# Altium project PCB_Project.PrjPcb
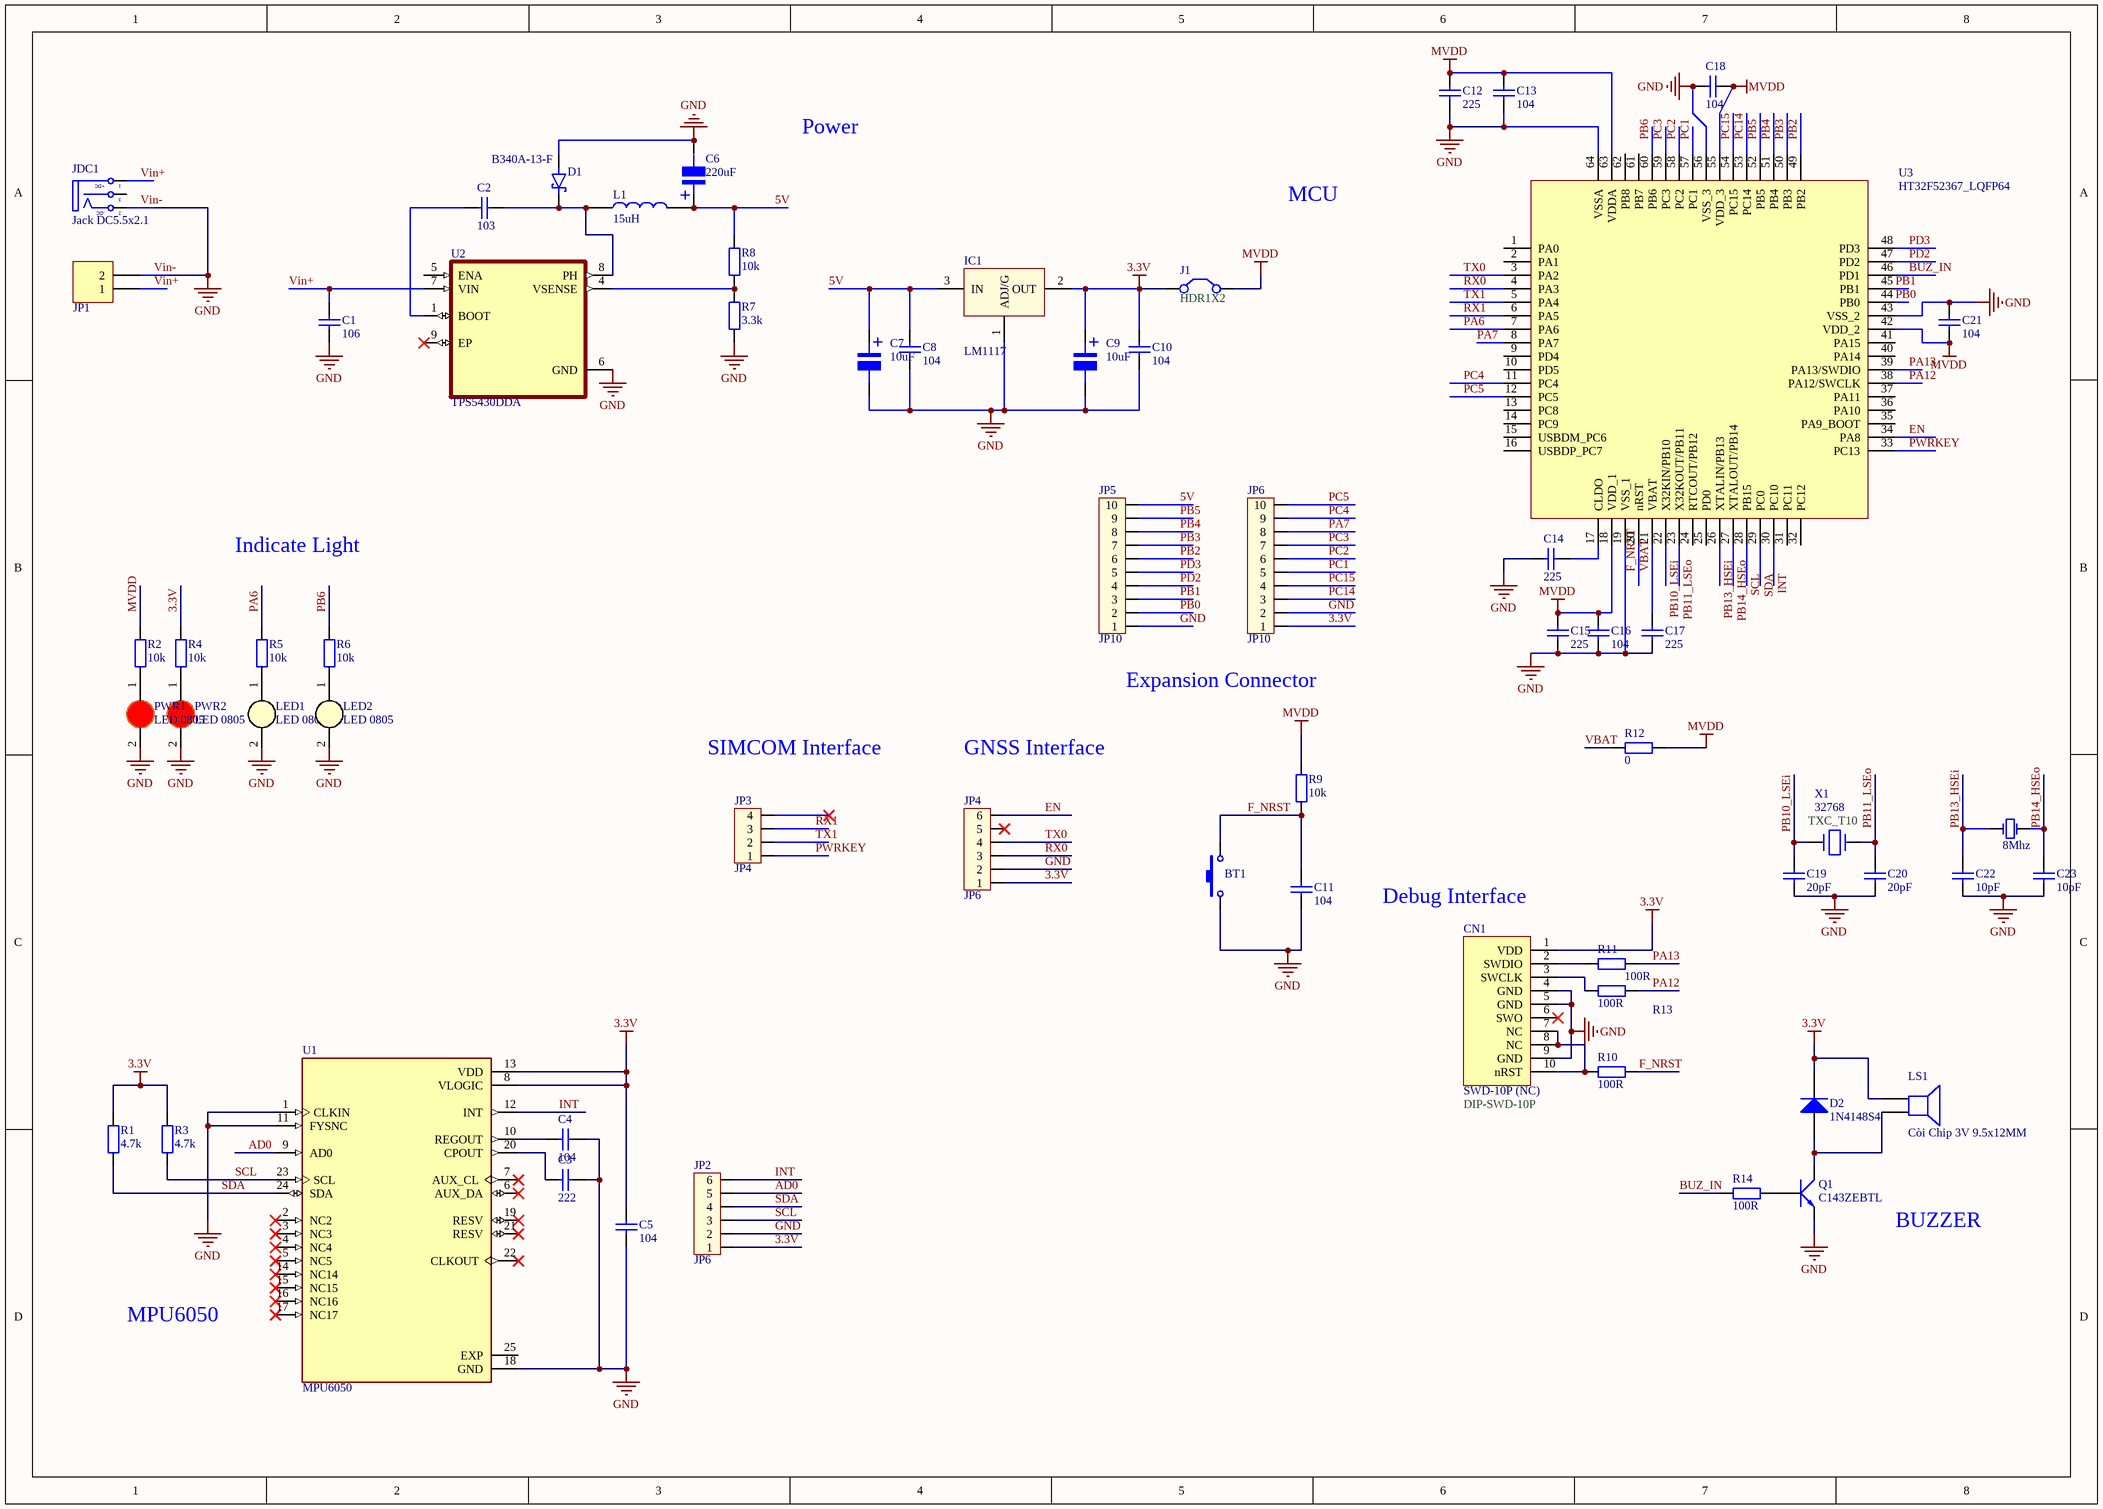
[diagram p0: Sheet1.SchDoc]
1 sheet, 62 parts. Net scope: global (net labels, ports and power ports of the same name join across sheets).
Board file: PCB1.PcbDoc

## Sheet Sheet1.SchDoc
size A3; SheetNumber: 1; SheetTotal: 1

### Parts
BT1  Nut Nhan 2 Chan SMD 3x6x2.5  [Nut Nhan 2 Chan SMD 3x6x2.5]  (value not drawn)
C1  106  [Tu 0805]
C2  103  [tu 0805]
C3  222  [tu 0805]
C4  104  [tu 0603]
C5  104  [tu 0603]
C6  220uF  [tu nhom 8 (e)]
C7  10uF  [tu nhom 4 (b)]
C8  104  [tu 0805]
C9  10uF  [tu nhom 4 (b)]
C10  104  [tu 0805]
C11  104  [tu 0603]
C12  225  [tu 0805]
C13  104  [tu 0603]
C14  225  [tu 0805]
C15  225  [tu 0805]
C16  104  [tu 0603]
C17  225  [tu 0805]
C18  104  [tu 0603]
C19  20pF  [tu 0805]
C20  20pF  [tu 0805]
C21  104  [tu 0603]
C22  10pF  [tu 0603]
C23  10pF  [tu 0603]
CN1  SWD-10P (NC)  [DIP-SWD-10P-2]
D1  B340A-13-F  [DIOM5226X240N]
D2  1N4148S4  [DIODE SOD-123]
IC1  LM1117  [SOT223-4N]
J1  Jumper  [HDR1X2]  (value not drawn)
JDC1  Jack DC5.5x2.1  [DC-IN]
JP1  Header 2_1  [HED2]  (value not drawn)
JP2  JP6  [CON6]
JP3  JP4  [CON4]
JP4  JP6  [CON6]
JP5  JP10  [CON10]
JP6  JP10  [CON10]
L1  15uH  [Cuon Cam 7x7x5]
LED1  LED 0805  [led 0805]
LED2  LED 0805  [led 0805]
LS1  Còi Chip 3V 9.5x12MM  [SPEAKER]
PWR1  LED 0805  [led 0805]
PWR2  LED 0805  [led 0805]
Q1  C143ZEBTL  [SOT23]
R1  4.7k  [tro smd 0805]
R2  10k  [TRO SMD 0603]
R3  4.7k  [tro smd 0805]
R4  10k  [TRO SMD 0603]
R5  10k  [TRO SMD 0603]
R6  10k  [TRO SMD 0603]
R7  3.3k  [tro smd 0805]
R8  10k  [tro smd 0805]
R9  10k  [tro smd 0603]
R10  100R  [tro smd 0805]
R11  100R  [tro smd 0805]
R12  0  [tro smd 0603]
R13  100R  [tro smd 0805]
R14  100R  [tro smd 0603]
U1  MPU6050  [IC_MPU6050]
U2  TPS5430DDA  [VREG_LM5017MR/NOPB]
U3  HT32F52367_LQFP64  [HT_LQFP64]
X1  32768  [TXC_T10]
Y1  8Mhz  [XT2]

### Nets
3.3V: C5.1 C9.1 C10.1 CN1.1(VDD) D2.2(K) IC1.2(OUT) J1.1(C1) JP2.1 JP4.1 JP6.1 LS1.1 R1.2 R3.2 R4.2 U1.8(VLOGIC) U1.13(VDD)
GND: BT1.1 C1.2 C3.1 C4.2 C5.2 C6.2 C7.2 C8.2 C9.2 C10.2 C11.2 C12.1 C13.1 C14.1 C15.2 C16.2 C17.1 C18.2 C19.2 C20.2 C21.2 C22.2 C23.2 CN1.4(GND) CN1.5(GND) CN1.9(GND) D1.A IC1.1(ADJ/G) JDC1.2(TN) JP1.2 JP2.2 JP4.2 JP5.1 JP6.2 LED1.2(K) LED2.2(K) PWR1.2(K) PWR2.2(K) Q1.2(E) R7.1 U1.1(CLKIN) U1.11(FYSNC) U1.18(GND) U2.6(GND) U3.19(VSS_1) U3.43(VSS_2) U3.56(VSS_3) U3.64(VSSA)  [also labelled Vin-]
MVDD: C12.2 C13.2 C15.1 C16.1 C18.1 C21.1 J1.2(C2) R2.2 R9.2 R12.1 U3.18(VDD_1) U3.42(VDD_2) U3.55(VDD_3) U3.63(VDDA)
5V: C6.1 C7.1 C8.1 IC1.3(IN) JP5.10 L1.2 R8.2
AD0: JP2.5 U1.9(AD0)
BUZ_IN: R14.1 U3.46(PD1)
EN: JP4.6 U3.34(PA8)
F_NRST: BT1.2 C11.1 R9.1 R10.2 U3.20(nRST)
INT: JP2.6 U1.12(INT) U3.30(PC10)
PA6: R5.2 U3.7(PA6)
PA7: JP6.8 U3.8(PA7)
PA12: R13.2 U3.38(PA12/SWCLK)
PA13: R11.2 U3.39(PA13/SWDIO)
PB0: JP5.2 U3.44(PB0)
PB1: JP5.3 U3.45(PB1)
PB2: JP5.6 U3.49(PB2)
PB3: JP5.7 U3.50(PB3)
PB4: JP5.8 U3.51(PB4)
PB5: JP5.9 U3.52(PB5)
PB6: R6.2 U3.60(PB6)
PB10_LSEi: C19.1 U3.22(X32KIN/PB10) X1.1
PB11_LSEo: C20.1 U3.23(X32KOUT/PB11) X1.2
PB13_HSEi: C22.1 U3.26(XTALIN/PB13) Y1.1(OSC1)
PB14_HSEo: C23.1 U3.27(XTALOUT/PB14) Y1.2(OSC2)
PC1: JP6.5 U3.57(PC1)
PC2: JP6.6 U3.58(PC2)
PC3: JP6.7 U3.59(PC3)
PC4: JP6.9 U3.11(PC4)
PC5: JP6.10 U3.12(PC5)
PC14: JP6.3 U3.53(PC14)
PC15: JP6.4 U3.54(PC15)
PD2: JP5.4 U3.47(PD2)
PD3: JP5.5 U3.48(PD3)
PWRKEY: JP3.1 U3.33(PC13)
RX0: JP4.3 U3.4(PA3)
RX1: JP3.3 U3.6(PA5)
SCL: JP2.3 R3.1 U1.23(SCL) U3.28(PB15)
SDA: JP2.4 R1.1 U1.24(SDA) U3.29(PC0)
TX0: JP4.4 U3.3(PA2)
TX1: JP3.2 U3.5(PA4)
VBAT: C17.2 R12.2 U3.21(VBAT)
Vin+: C1.1 JDC1.1(T) JP1.1 U2.7(VIN)
NetC2_1: C2.1 D1.C L1.1 U2.8(PH)
NetC2_2: C2.2 U2.1(BOOT)
NetC3_2: C3.2 U1.20(CPOUT)
NetC4_1: C4.1 U1.10(REGOUT)
NetC14_2: C14.2 U3.17(CLDO)
NetCN1_2: CN1.2(SWDIO) R11.1
NetCN1_3: CN1.3(SWCLK) R13.1
NetCN1_7: CN1.7(NC) CN1.8(NC) CN1.10(nRST) R10.1
NetD2_1: D2.1(A) LS1.2 Q1.3(C)
NetLED1_1: LED1.1(A) R5.1
NetLED2_1: LED2.1(A) R6.1
NetPWR1_1: PWR1.1(A) R2.1
NetPWR2_1: PWR2.1(A) R4.1
NetQ1_1: Q1.1(B) R14.2
NetR7_2: R7.2 R8.1 U2.4(VSENSE)

Not connected (* = marked no-connect by the designer): CN1 6(SWO)*; JDC1 3(S); JP3 4*; JP4 5*; U1 2(NC2)* 3(NC3)* 4(NC4)* 5(NC5)* 6(AUX_DA)* 7(AUX_CL)* 14(NC14)* 15(NC15)* 16(NC16)* 17(NC17)* 19(RESV)* 21(RESV)* 22(CLKOUT)* 25(EXP); U2 5(ENA) 9(EP)*; U3 1(PA0) 2(PA1) 9(PD4) 10(PD5) 13(PC8) 14(PC9) 15(USBDM_PC6) 16(USBDP_PC7) 24(RTCOUT/PB12) 25(PD0) 31(PC11) 32(PC12) 35(PA9_BOOT) 36(PA10) 37(PA11) 40(PA14) 41(PA15) 61(PB7) 62(PB8)

### Notes on the sheet
- Labels drawn without touching a wire or pin: BUZZER, Debug Interface, Expansion Connector, GNSS Interface, Indicate Light, MCU, MPU6050, Power, SIMCOM Interface
- (in symbol Jac_DC) +DC; -DC
- (in symbol Tu Nhom 10uF 16V) +
- (in symbol Tu Nhom 220uF 10V) +

### Library data of the parts
BT1 = Nut Nhan 2 Chan SMD 3x6x2.5: Ma_Hang: MH001036; Ten: Nút Nhấn 2 Chân 3x6x2.5MM SMD
C1 = Tu 0805 106 16V 10%: Dán; Ten_Linh_Kien: Tụ 0805 106-10uF 10% 16V; So_Chan: 2; Don_Vi: Con; Ma_Hang: MH004553; Chung_Loai: Dán; Kieu_Chan: *
C2 C8 C10 = Tu 0805 104 50V 10%: Dán; Don_Vi: Con; So_Chan: 2; Ten_Linh_Kien: Tụ 0805 104-100nF 10% 50V; Ma_Hang: MH004551; Chung_Loai: Dán; Kieu_Chan: *
C3 = Tu 0805 222 50V 10%: Dán; Don_Vi: Con; So_Chan: 2; Ten_Linh_Kien: Tụ 0805 222-2.2nF 10% 50V; Ma_Hang: MH004557; Chung_Loai: Dán; Kieu_Chan: *
C4 C5 C11 C13 C16 C18 C21-C23 = Tu 0603 104 50V 10%: Dán; Don_Vi: Con; So_Chan: 2; Ten_Linh_Kien: Tụ 0603 104-100nF 10% 50V; Ma_Hang: MH004568; Chung_Loai: Dán; Kieu_Chan: *
C6 = Tu Nhom 220uF 10V: Dán; So_Chan: 2; Ten_Linh_Kien: Tụ Nhôm 220uF 10V; Ma_Hang: MH004021; Don_Vi: Con; Chung_Loai: Dán; Kieu_Chan: *
C7 C9 = Tu Nhom 10uF 16V: Dán; Don_Vi: Con; So_Chan: 2; Ten_Linh_Kien: Tụ Nhôm 10uF 16V 4x5MM; Ma_Hang: MH001458; Chung_Loai: Dán; Kieu_Chan: *
C12 C14 C15 C17 = Tu 0805 225 25V 10%: Dán; Don_Vi: Con; So_Chan: 2; Ten_Linh_Kien: Tụ 0805 225-2.2uF 25V 10%; Ma_Hang: MH007483; Chung_Loai: Dán; Kieu_Chan: *
C19 C20 = Tu 0805 20pF 50V 10%: Dán; Don_Vi: Con; Ten_Linh_Kien: Tụ 0805 20P 10% 50V; So_Chan: 2; Ma_Hang: MH004558; Chung_Loai: Dán; Kieu_Chan: *
CN1 = DIP-SWD-10P: SWD Connector; Package: DIP-SWD-10P
D1 = B340A-13-F: Diode Schottky 40V 3A Surface Mount SMA; MF: Diodes Inc.; Availability: Unavailable; MP: B340A-13-F; Price: None; Value: *; SnapEDA_Link: https://www.snapeda.com/parts/B340A-13-F/Diodes%20Inc./view-part/78704/?ref=snap; Package: DO-214 Diodes Inc.
D2 = Diode S4: Dán; Ten_Linh_Kien: Diode S4 SOD123 ( 1N5819 SOD123); Ma_Hang: MH005519; Don_Vi: Con; Ghi_Chu: *; Chung_Loai: Dán; Kieu_Chan: *
IC1 = LM1117: Available in 1.8V, 2.5V, 2.85V, 3.3V, 5V, and  Adjustable Versions; Value: LM317
J1 = Jumper: Jumper Wire; Package: HDR1X2
JDC1 = Jac_DC: Cắm; Ten_Linh_Kien: Jack DC5.5x2.1MM DC5501; Ma_Hang: MH000923; Don_Vi: Con; Kieu_Chan: *; Ghi_Chu: *; Chung_Loai: Cắm
JP1 = Header 2_1: Header, 2-Pin; Manufacturer: Generic Components; Class: Connector; Value: Header 2
JP2 JP4 = Con6: Connector 6; Value: Connector 6
JP3 = Con4: Connector 4; Value: Connector 4
JP5 JP6 = Con10: Connector 10; Value: Connector 10
L1 = CUON CAM 47uH SMD: Dán; Don_Vi: Con; Ma_Hang: MH004211; Ten_Linh_Kien: Cuộn Cảm 47uH 7x7x4MM CD74R; Ghi_Chu: *; Kieu_Chan: *; Chung_Loai: Dán
LED1 LED2 = LED 0805 Trang: Dán; Don_Vi: Con; Ma_Hang: MH002946; Ten_Linh_Kien: LED 0805 Màu Trắng ( White); Ghi_Chu: *; Kieu_Chan: *; Chung_Loai: Dán
LS1 = Coi Chip 5V: Cắm; Ten_Linh_Kien: Còi Chip 5V 9.5x12MM; Don_Vi: Con; Ma_Hang: MH000902; Ghi_Chu: *; Kieu_Chan: *; Chung_Loai: Cắm
PWR1 PWR2 = LED 0805 Do: Dán; Don_Vi: Con; Ma_Hang: MH000897; Ten_Linh_Kien: LED 0805 Màu Đỏ (Red); Ghi_Chu: *; Kieu_Chan: *; Chung_Loai: Dán
Q1 = C1815 HF SMD: NPN transistor; Value: C9014
R1 R3 = Tro 0805 5% 4.7k: Dán; Don_Vi: Con; So_Chan: 2; Ten_Linh_Kien: Trở 0805 5% 4.7k; Ma_Hang: MH005307; Chung_Loai: Dán; Kieu_Chan: *
R2 R4-R6 = Tro 0603 1% 10k: Dán; Don_Vi: Con; So_Chan: 2; Ten_Linh_Kien: Trở 0603 1% 10k; Ma_Hang: MH006333; Chung_Loai: Dán; Kieu_Chan: *
R7 = Tro 0805 1% 3.3k: Dán; Don_Vi: Con; So_Chan: 2; Ten_Linh_Kien: Trở 0805 1% 3.3k; Ma_Hang: MH005472; Chung_Loai: Dán; Kieu_Chan: *
R8 = Tro 0805 5% 10k: Dán; Don_Vi: Con; So_Chan: 2; Ten_Linh_Kien: Trở 0805 5% 10k; Ma_Hang: MH005239; Chung_Loai: Dán; Kieu_Chan: *
R9 R12 = Tro 0603 5% 10k: Dán; Don_Vi: Con; So_Chan: 2; Ten_Linh_Kien: Trở 0603 5% 10k; Ma_Hang: MH006316; Chung_Loai: Dán; Kieu_Chan: *
R10 R11 R13 = Tro 0805 5% 100R: Dán; Don_Vi: Con; So_Chan: 2; Ten_Linh_Kien: Trở 0805 5% 100R; Ma_Hang: MH005251; Chung_Loai: Dán; Kieu_Chan: *
R14 = Tro 0603 5% 100R: Dán; Don_Vi: Con; So_Chan: 2; Ten_Linh_Kien: Trở 0603 5% 100R; Ma_Hang: MH006315; Chung_Loai: Dán; Kieu_Chan: *
U1 = MPU6050: Accelerometer, Gyroscope, 6 Axis Sensor IÂ²C Output; MF: TDK InvenSense; Price: None; Package: VFQFN-24 TDK InvenSense; Value: *; MP: MPU6050; Availability: Unavailable; SnapEDA_Link: https://www.snapeda.com/parts/MPU6050/TDK%20InvenSense/view-part/3605706/?ref=snap
U2 = TPS5430DDA: 5.5Vè‡³36Vè¾“å…¥ï¼Œ3Aï¼Œ500kHzé™åŽ‹è½¬æ¢å™¨; MF: Texas Instruments; Availability: Unavailable; Value: *; Mouser-Purchase-URL: https://snapeda.com/shop?store=Mouser&id=226174; Texas_Instruments-Purchase-URL: https://snapeda.com/shop?store=Texas+Instruments&id=226174; Package: HSOIC-8 Texas Instruments; DigiKey-Purchase-URL: https://snapeda.com/shop?store=DigiKey&id=226174; Price: None; SnapEDA_Link: https://www.snapeda.com/parts/TPS5430DDA/Texas%20Instruments/view-part/226174/?ref=snap; MP: TPS5430DDA
X1 = XTAL_TXC-T10: SMD XTAL; Package: TXC_T10
Y1 = Thach Anh 8Mhz DIP: Cắm; Don_Vi: Con; Ghi_Chu: *; Ma_Hang: *; Kieu_CHan: *; Chung_Loai: Cắm
U3 = HT32F52367_LQFP64: Mpn: *; Value: *; Mfr: *